# EasyEDA Pro project Temp_Con_V116.eprj, schematic TEMP_PWR
Board Name: TEMP_PWR; Create Date: 2025-01-22; Page Name: P1; Project Name: Temp_Con_V116; Schematic Name: TEMP_PWR; Update Date: 2025-01-28; Company: EasyEDA.com; Page Size: A4; Version: V1.0
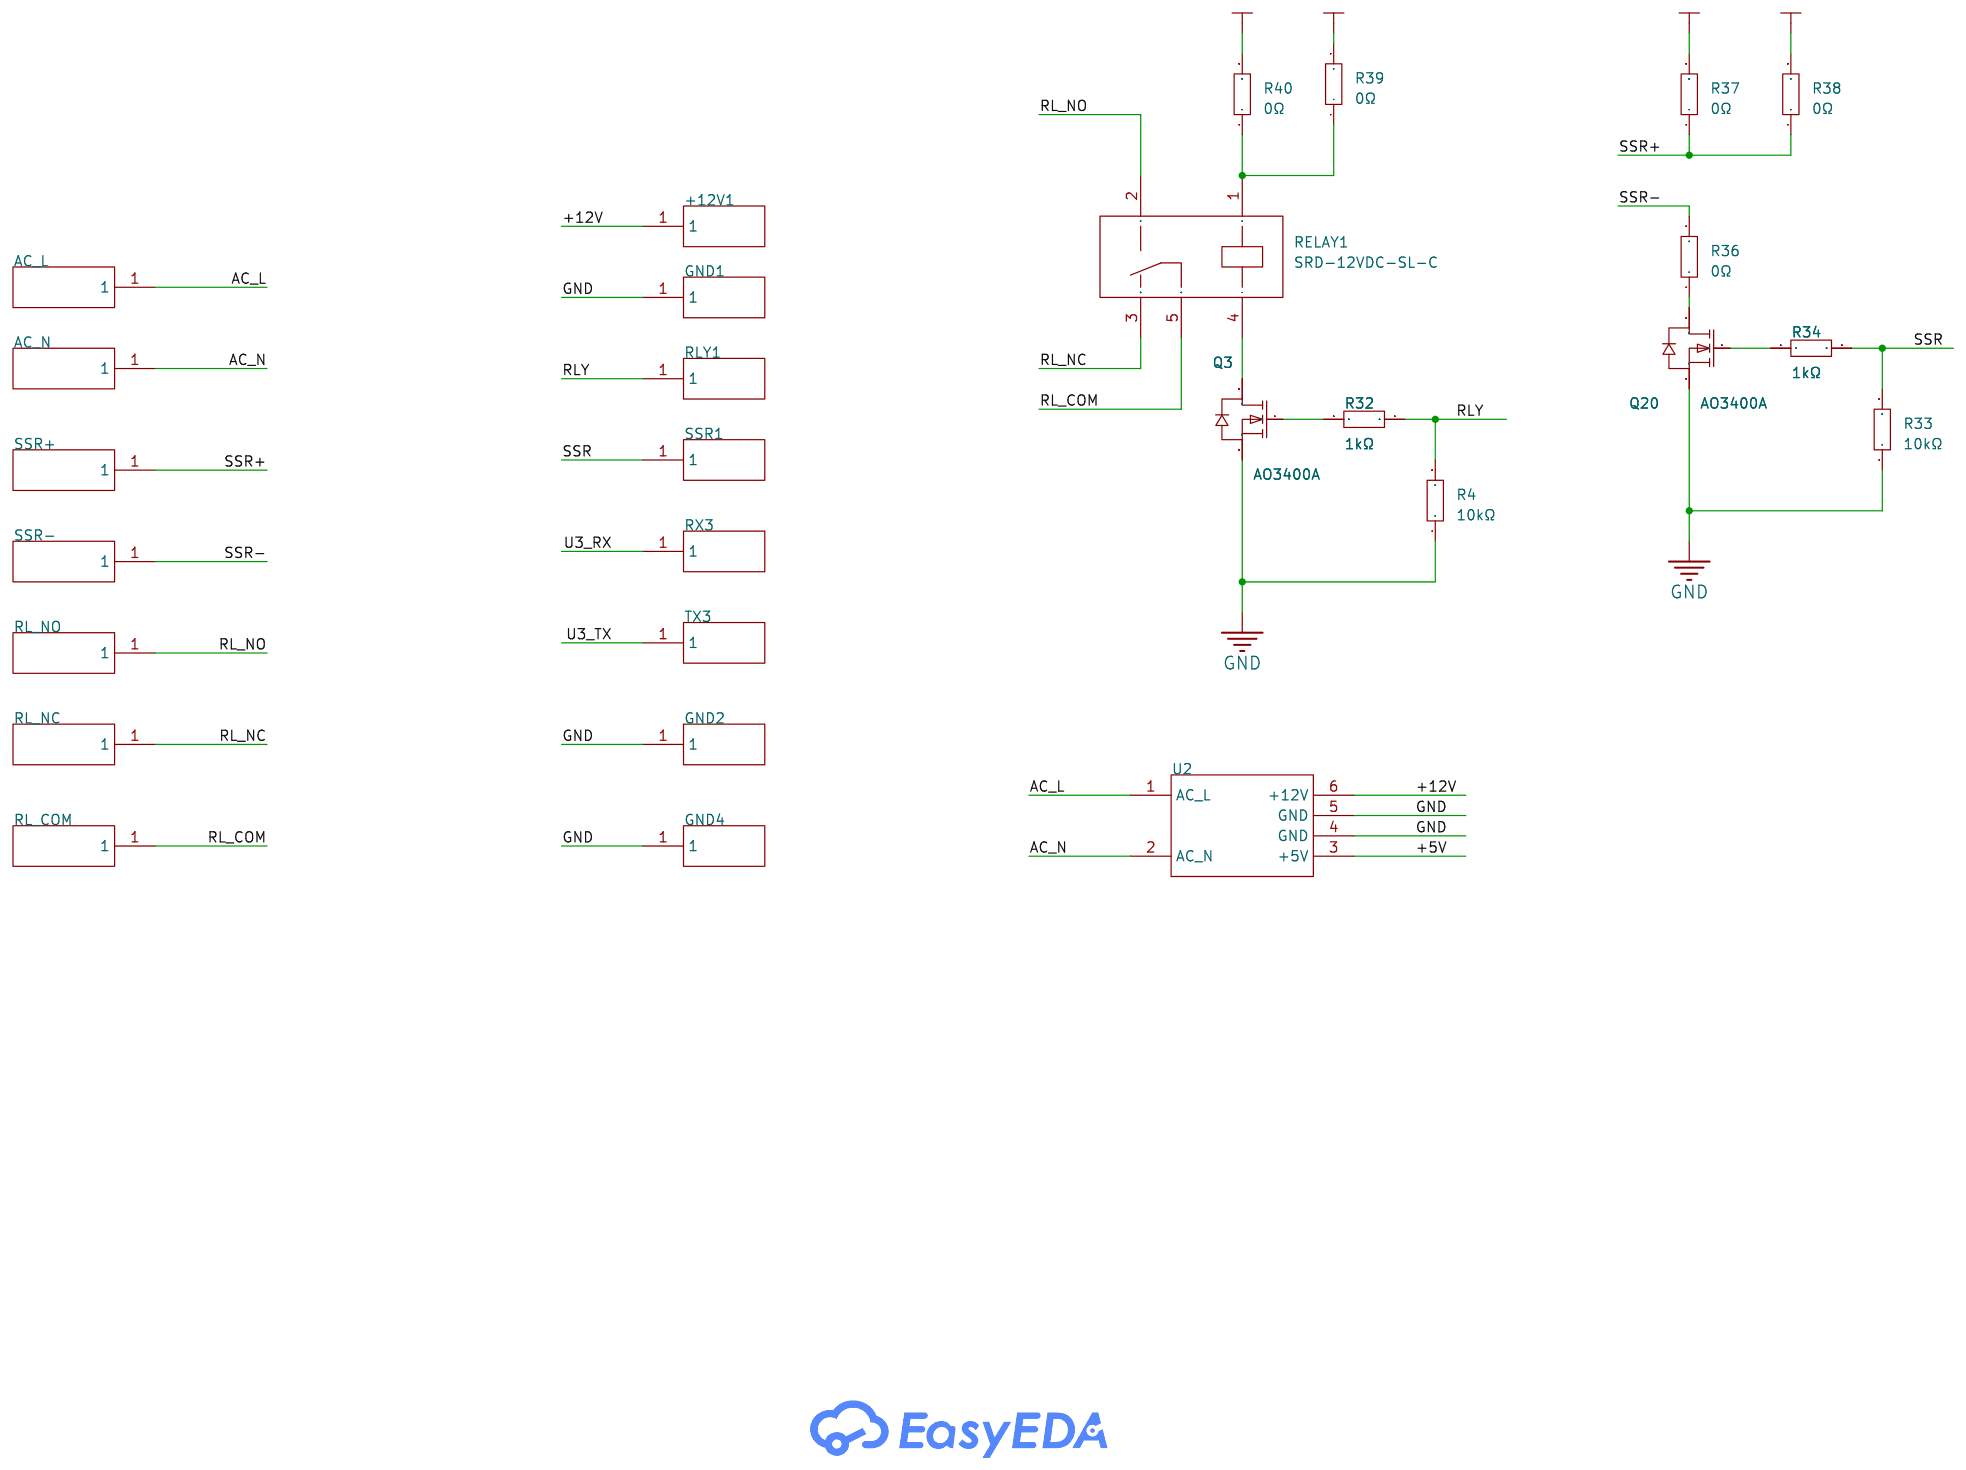
[diagram p3: schematic sheet]

## Parts
+12V1  -  [S_FT]  (no BOM)
AC_L  -  [B_FT]  (no BOM)
AC_N  -  [B_FT]  (no BOM)
GND1  -  [S_FT]  (no BOM)
GND2  -  [S_FT]  (no BOM)
GND4  -  [S_FT]  (no BOM)
Q3  AO3400A  [SOT-23-3_L2.9-W1.3-P1.90-LS2.4-BR]
Q20  AO3400A  [SOT-23-3_L2.9-W1.3-P1.90-LS2.4-BR]
R4  10kΩ  [R0805]
R32  1kΩ  [R0805]
R33  10kΩ  [R0805]
R34  1kΩ  [R0805]
R36  0Ω  [R0805]
R37  0Ω  [R0805]
R38  0Ω  [R0805]  (no BOM)
R39  0Ω  [R0805]  (no BOM)
R40  0Ω  [R0805]
RELAY1  SRD-12VDC-SL-C  [RELAY-TH_SRD-XXVDC-XL-C]
RL_COM  -  [B_FT]  (no BOM)
RL_NC  -  [B_FT]  (no BOM)
RL_NO  -  [B_FT]  (no BOM)
RLY1  -  [S_FT]  (no BOM)
RX3  -  [S_FT]  (no BOM)
SSR1  -  [S_FT]  (no BOM)
SSR+  -  [B_FT]  (no BOM)
SSR-  -  [B_FT]  (no BOM)
TX3  -  [S_FT]  (no BOM)
U2  -  [P_MOD1]

## Library data of the parts
+12V1 GND1 GND2 GND4 RLY1 RX3 SSR1 TX3 = S_TM
AC_L AC_N RL_COM RL_NC RL_NO SSR+ SSR- = B_TM
Q3 Q20 = AO3400A_C347475: LCSC Part Name: 1个N沟道 耐压:30V 电流:5.8A; Supplier Part: C347475; Manufacturer: UMW(友台半导体); Supplier Footprint: SOT-23; JLCPCB Part Class: Extended Part; Datasheet: https://atta.szlcsc.com/upload/public/pdf/source/20231109/50AB4FB4D66E55864F9B8D027B723C9A.pdf; Supplier: LCSC; Type: 1 N-Channel; Drain Source On Resistance (RDS(on)@Vgs,Id): 28mΩ@10V,5.8A; Gate Threshold Voltage (Vgs(th)@Id): 1.4V@250uA; Total Gate Charge (Qg@Vgs): 12nC@10V; Input Capacitance (Ciss@Vds): 1050pF@24V; Reverse Transfer Capacitance (Crss@Vds): 77pF@15V; Operating Temperature: -55℃~+150℃; Check: true
R4 R33 = RC0805FR-0710KL: LCSC Part Name: 厚膜电阻 10kΩ ±1% 125mW; Supplier Part: C84376; Manufacturer: YAGEO(国巨); Supplier Footprint: 0805; JLCPCB Part Class: Extended Part; Datasheet: https://atta.szlcsc.com/upload/public/pdf/source/20170708/1499509500945.pdf; Supplier: LCSC; Type: Thick Film Resistors; Tolerance: ±1%; Temperature Coefficient: ±100ppm/℃; Operating Temperature Range: -55℃~+155℃; Check: true
R32 R34 = RC0805FR-071KL: LCSC Part Name: 厚膜电阻 1kΩ ±1% 125mW; Supplier Part: C95781; Manufacturer: YAGEO(国巨); Supplier Footprint: 0805; JLCPCB Part Class: Extended Part; Datasheet: https://atta.szlcsc.com/upload/public/pdf/source/20170708/1499509500945.pdf; Supplier: LCSC; Type: Thick Film Resistors; Tolerance: ±1%; Temperature Coefficient: ±100ppm/℃; Operating Temperature Range: -55℃~+155℃; Check: true
R36-R40 = RC0805JR-070RL: LCSC Part Name: 厚膜电阻 0Ω ±5% 125mW; Supplier Part: C96345; Manufacturer: YAGEO(国巨); Supplier Footprint: 0805; JLCPCB Part Class: Extended Part; Datasheet: https://atta.szlcsc.com/upload/public/pdf/source/20170708/1499509500945.pdf; Supplier: LCSC; Type: Thick Film Resistors; Tolerance: ±5%; Operating Temperature Range: -55℃~+155℃; Check: true
RELAY1 = SRD-12VDC-SL-C: Supplier Part: C30431; Manufacturer: 松乐; Supplier Footprint: 插件,15.6x19.2mm; JLCPCB Part Class: Extended Part; Datasheet: https://atta.szlcsc.com/upload/public/pdf/source/20200305/C490149_C96E4098A3B1FFB377D5AD2E40B7C2A8.pdf; Supplier: LCSC; Coil Voltage: 12V; Contact Form: One Conversion: 1C (SPDT-Conversion); Pin Number: 5; Maximum Switching Voltage: 250V@AC; Coil Rated Power: 360mW; Maximum Switching Current: 15A; Coil Type: Non-polar - Single Coil; Coil Resistance: 400Ω; Contact Resistance: 100mΩ; Operate Time: 10ms; Release Time: 10ms; Check: true
U2 = P_12V5V_MOD

## Nets
+5V: R38.2 R39.2 U2.3(+5V)
+12V: +12V1.1 R37.2 R40.2 U2.6(+12V)
GND: GND1.1 GND2.1 GND4.1 Q3.2(S) Q20.2(S) R4.1 R33.1 U2.4(GND) U2.5(GND)
AC_L: AC_L.1 U2.1(AC_L)
AC_N: AC_N.1 U2.2(AC_N)
RL_COM: RELAY1.5 RL_COM.1
RL_NC: RELAY1.3 RL_NC.1
RL_NO: RELAY1.2 RL_NO.1
RLY: R4.2 R32.2 RLY1.1
SSR: R33.2 R34.2 SSR1.1
SSR+: R37.1 R38.1 SSR+.1
SSR-: R36.2 SSR-.1
U3_RX: RX3.1
U3_TX: TX3.1
$1N448: Q3.3(D) RELAY1.4
$1N449: R39.1 R40.1 RELAY1.1
$1N452: Q3.1(G) R32.1
$1N459: Q20.1(G) R34.1
$1N1061: Q20.3(D) R36.1
